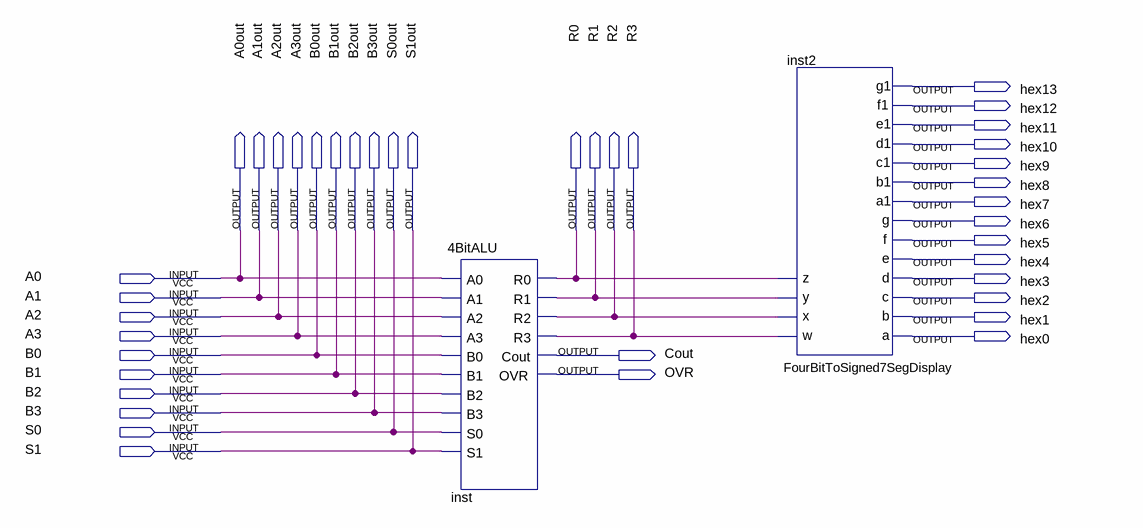
[diagram p0: schematic sheet]
// Quartus schematic Lab7.bdf as structural Verilog: 2 symbols, 40 pins
module Lab7 (
  input  A0,
  input  A1,
  input  A2,
  input  A3,
  input  B0,
  input  B1,
  input  B2,
  input  B3,
  input  S0,
  input  S1,
  output hex13,
  output hex12,
  output hex11,
  output hex10,
  output hex9,
  output hex8,
  output hex7,
  output hex6,
  output A0out,
  output A1out,
  output A2out,
  output A3out,
  output B0out,
  output B1out,
  output B2out,
  output B3out,
  output S0out,
  output S1out,
  output R0,
  output R1,
  output R2,
  output R3,
  output hex5,
  output hex4,
  output hex3,
  output hex2,
  output hex1,
  output hex0,
  output Cout,
  output OVR
);

  \4BitALU  inst (
    .A0(A0), .A1(A1), .A2(A2), .A3(A3), .B0(B0), .B1(B1), .B2(B2), .B3(B3), .S0(S0), .S1(S1), .R0(R0),
    .R1(R1), .R2(R2), .R3(R3), .Cout(Cout), .OVR(OVR));
  FourBitToSigned7SegDisplay inst2 (
    .w(R3), .x(R2), .y(R1), .z(R0), .a(hex0), .b(hex1), .c(hex2), .d(hex3), .e(hex4), .f(hex5), .g(hex6),
    .a1(hex7), .b1(hex8), .c1(hex9), .d1(hex10), .e1(hex11), .f1(hex12), .g1(hex13));

  assign A0out = A0;
  assign A1out = A1;
  assign A2out = A2;
  assign A3out = A3;
  assign B0out = B0;
  assign B1out = B1;
  assign B2out = B2;
  assign B3out = B3;
  assign S0out = S0;
  assign S1out = S1;
endmodule
